# EAGLE design RS14-BatLockPCB (EAGLE 6.5.0)
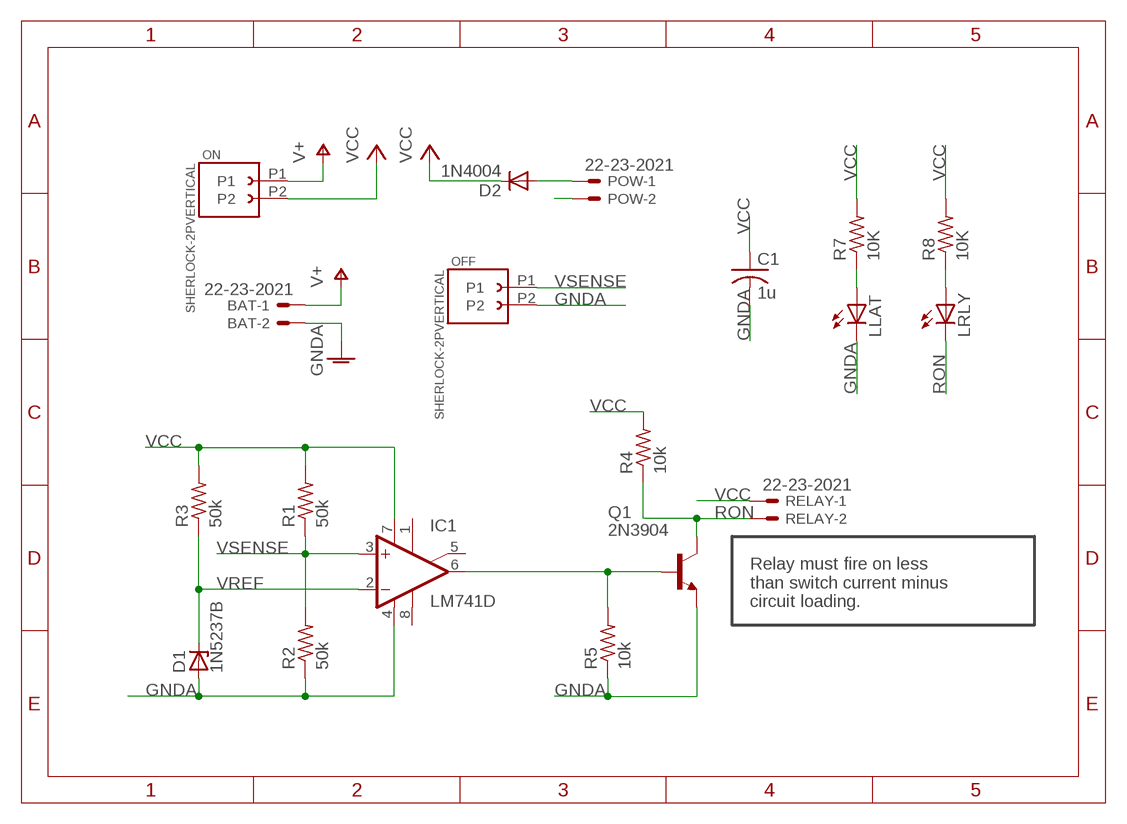
[diagram p0: schematic, sheet 1]

## Parts
BAT  22-23-2021  [22-23-2021]
C1  1u  C-US025-025X050  [C025-025X050]
D1  1N5237B  1N821  [DO35Z10]
D2  1N4004  [DO41-10]
IC1  LM741D  [SO08]
LLAT  LED3MM  [LED3MM]
LRLY  LED3MM  [LED3MM]
OFF  SHERLOCK-2PVERTICAL  [35362-02**]
ON  SHERLOCK-2PVERTICAL  [35362-02**]
POW  22-23-2021  [22-23-2021]
Q1  2N3904  [TO92]
R1  50k  R-US_0204/7  [0204/7]
R2  50k  R-US_0204/7  [0204/7]
R3  50k  R-US_0204/7  [0204/7]
R4  10k  R-US_0204/7  [0204/7]
R5  10k  R-US_0204/7  [0204/7]
R7  10K  R-US_0204/7  [0204/7]
R8  10K  R-US_0204/7  [0204/7]
RELAY  22-23-2021  [22-23-2021]

## Nets
GNDA: BAT.2 C1.2 D1.A IC1.4(V-) LLAT.K(C) OFF.P2 Q1.3(E) R2.1 R5.1
N$1: IC1.6(OUT) Q1.2(B) R5.2
N$2: POW.2
N$4: D2.A POW.1
N$7: LLAT.A R7.1
N$8: LRLY.A R8.1
RON: LRLY.K(C) Q1.1(C) R4.1 RELAY.2
V+: BAT.1 ON.P1
VCC: C1.1 D2.C IC1.7(V+) ON.P2 R1.2 R3.2 R4.2 R7.2 R8.2 RELAY.1
VREF: D1.C IC1.2(-IN) R3.1
VSENSE: IC1.3(+IN) OFF.P1 R1.1 R2.2
Unconnected: IC1.1(ON1) IC1.5(ON2) IC1.8(OPT)

## Notes on the sheet
- Relay must fire on less
  than switch current minus
  circuit loading.

## Library data of the parts
BAT POW RELAY = con-molex:22-23-2021: .100" (2.54mm) Center Header - 2 Pin; MF: MOLEX; MPN: 22-23-2021; OC_FARNELL: 1462926; OC_NEWARK: 25C3832
C1 = rcl:C-US: CAPACITOR, American symbol
D1 = diode:1N821: Reference DIODE temperature compensated, 6,2 V
D2 = diode:1N4004: DIODE general purpose rectifier, 1 A
IC1 = linear:*741: OP AMP
LLAT LRLY = led:LED: LED OSRAM: - CHIPLED LG R971, LG N971, LY N971, LG Q971, LY Q971, LO R971, LY R971 LH N974, LH R974 LS Q976, LO Q976, LY Q976 LO Q996 - Hyper CHIPLED LW Q18S LB Q993, LB Q99A, LB R99A - SideLED LS A670, LO A670, LY A670, LG A670, LP A670 LB A673, LV A673, LT A673, LW A673 LH A674 LY A675 LS A676, LA A676, LO A676, LY A676, LW A676 LS A679, LY A679, LG A679 - Hyper Micro SIDELED® LS Y876, LA Y876, LO Y876, LY Y876 LT Y87S - SmartLED LW L88C, LW L88S LB L89C, LB L89S, LG L890 LS L89K, LO L89K, LY L89K LS L896, LA L896, LO L896, LY L896 - TOPLED LS T670, LO T670, LY T670, LG T670, LP T670 LSG T670, LSP T670, LSY T670, LOP T670, LYG T670 LG T671, LOG T671, LSG T671 LB T673, LV T673, LT T673, LW T673 LH T674 LS T676, LA T676, LO T676, LY T676, LB T676, LH T676, LSB T676, LW T676 LB T67C, LV T67C, LT T67C, LS T67K, LO T67K, LY T67K, LW E67C LS E67B, LA E67B, LO E67B, LY E67B, LB E67C, LV E67C, LT E67C LW T67C LS T679, LY T679, LG T679 LS T770, LO T770, LY T770, LG T770, LP T770 LB T773, LV T773, LT T773, LW T773 LH T774 LS E675, LA E675, LY E675, LS T675 LS T776, LA T776, LO T776, LY T776, LB T776 LHGB T686 LT T68C, LB T68C - Hyper Mini TOPLED® LB M676 - Mini TOPLED Santana® LG M470 LS M47K, LO M47K, LY M47K Source: http://www.osram.convergy.de LUXEON: - LUMILED® LXK2-PW12-R00, LXK2-PW12-S00, LXK2-PW14-U00, LXK2-PW14-V00 LXK2-PM12-R00, LXK2-PM12-S00, LXK2-PM14-U00 LXK2-PE12-Q00, LXK2-PE12-R00, LXK2-PE12-S00, LXK2-PE14-T00, LXK2-PE14-U00 LXK2-PB12-K00, LXK2-PB12-L00, LXK2-PB12-M00, LXK2-PB14-N00, LXK2-PB14-P00, LXK2-PB14-Q00 LXK2-PR12-L00, LXK2-PR12-M00, LXK2-PR14-Q00, LXK2-PR14-R00 LXK2-PD12-Q00, LXK2-PD12-R00, LXK2-PD12-S00 LXK2-PH12-R00, LXK2-PH12-S00 LXK2-PL12-P00, LXK2-PL12-Q00, LXK2-PL12-R00 Source: www.luxeon.com KINGBRIGHT: KA-3528ASYC Source: www.kingbright.com
OFF ON = rs-molex-sherlock:SHERLOCK-2P: 2-pin Molex SherlockTM connector system Verticle 35362-02** Right Angle 35363-026** Mates with: 35507-0200 header 50212-8100 pins Use 63819-0500 crimper, and 57105-6000 pin extraction tool.
Q1 = transistor-npn:2N3904: NPN Transistor
R1-R5 R7 R8 = rcl:R-US_: RESISTOR, American symbol

## Net classes
0 default: clearance 0.205 mm

## Board
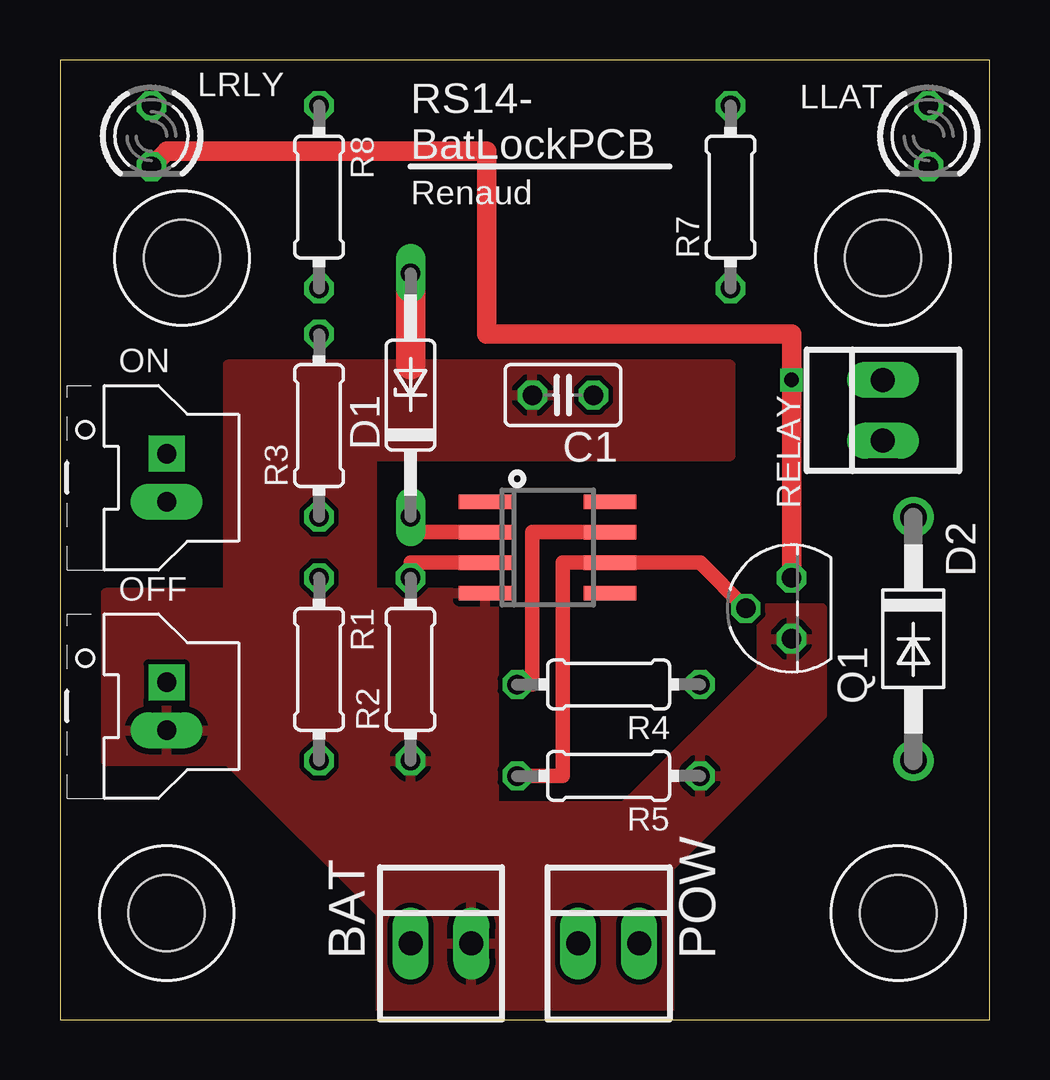
[diagram p1: board, top side]
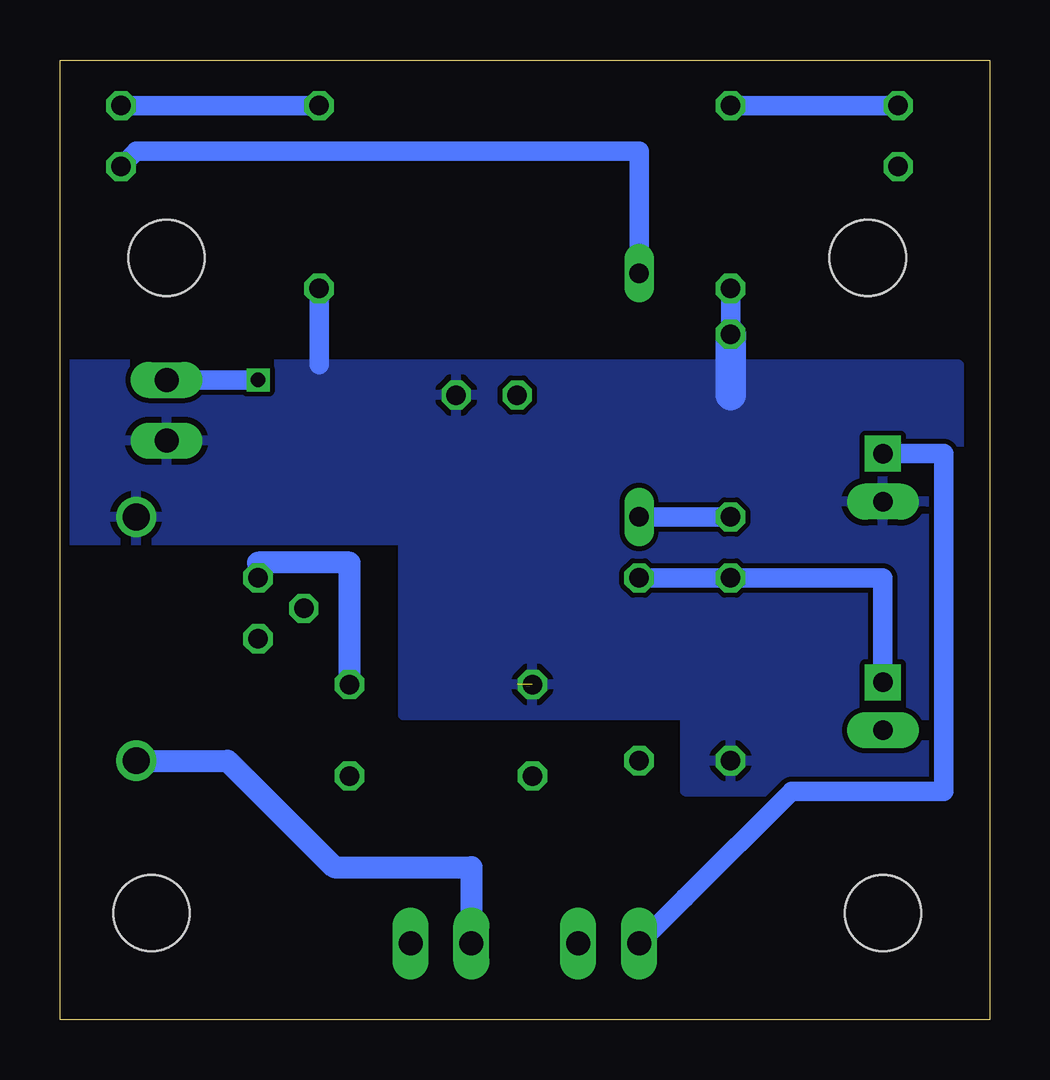
[diagram p2: board, bottom side, seen from below]

Size 38.73 x 40 mm. Coordinates in mm from the lower left corner, seen from the top.
Outline: 0,0 38.73,0 38.73,40 0,40 0,0
Copper layers (1*16): Top 0.0356mm / dielectric 1.5011mm / Bottom 0.0356mm
Design rules "LaenPCBOrder": minimum track width 6mil, minimum drill 13mil, track to track 6mil, track to pad 6mil, pad to pad 6mil, via to via 6mil, smd to smd 6mil, copper to edge 15mil, drill to drill 6mil, minimum pad ring 7mil, minimum via ring 7mil, stop-mask expansion 4mil, vias tented up to drill 0mil, thermal gap 10mil
Holes 3.17 mm at 4.45,4.45 34.93,4.45 34.29,31.75 5.08,31.75

### Footprints (pad centres in the part's own frame; a part is rotated, then mirrored left to right if it is on the bottom)
22-23-2021 = drill 1 long: 1 -1.27,0; 2 1.27,0
C025-025X050 = drill 0.813 octagon: 1 -1.27,0; 2 1.27,0
DO35Z10 = drill 0.813 long: A 5.08,0; C -5.08,0
DO41-10 = drill 1.118: A 5.08,0; C -5.08,0
SO08 = smd 0.6 x 2.2: 1 -1.905,-2.6; 2 -0.635,-2.6; 3 0.635,-2.6; 4 1.905,-2.6; 5 1.905,2.6; 6 0.635,2.6; 7 -0.635,2.6; 8 -1.905,2.6
LED3MM = drill 0.813 octagon: A -1.27,0; K 1.27,0
35362-02** = drill 0.8 pad 1.5 square: P1 -2,0 | drill 0.8 pad 1.5 long: P2 0,0
TO92 = drill 0.813 octagon: 1 1.27,0; 2 0,1.905; 3 -1.27,0
0204/7 = drill 0.813 octagon: 1 -3.81,0; 2 3.81,0

### Placement (x,y rotation side)
BAT  15.88,3.18 0 top
C1  20.95,26.04 180 top
D1  14.61,26.04 90 top
D2  35.56,15.87 270 top
IC1  20.32,19.69 270 top
LLAT  36.2,36.83 270 top
LRLY  3.81,36.83 270 top
OFF  4.45,12.06 270 top
ON  4.45,21.59 270 top
POW  22.86,3.18 0 top
Q1  30.48,17.14 90 top
R1  10.79,14.6 270 top
R2  14.61,14.6 90 top
R3  10.79,24.77 90 top
R4  22.86,13.97 180 top
R5  22.86,10.16 180 top
R7  27.94,34.29 270 top
R8  10.79,34.29 270 top
RELAY  34.29,25.4 90 top

### Tracks (layer width: path | path; a pad name or v marks a point on that pad's centre or on a via)
GNDA
  Top 1.219: D1.A 14.61,27.3
  Bottom 0.813: LLAT.K 35.56,36.2 14.61,36.2 D1.A
  pour Top: 25.4,0 25.4,6.35 31.75,12.7 31.75,17.14 29.21,17.14 29.21,14.6 23.49,8.89 18.1,8.89 18.1,17.78 13.02,17.78 13.02,23.5 27.94,23.5 27.94,27.3 6.99,27.3 6.99,17.78 1.91,17.78 1.91,10.79 6.99,10.79 13.34,4.45 13.34,0
N$1
  Top 0.61: Q1.2 26.67,19.05 IC1.6 20.95,19.05 20.95,10.16 R5.2
N$4
  Bottom 0.914: D2.A 31.75,10.79 27.3,6.35 21.59,6.35 POW.1
N$7
  Bottom 0.813: LLAT.A R7.1
N$8
  Bottom 0.813: LRLY.A R8.1
RON  (via drill 0.6)
  Top 0.813: Q1.1 v30.48,26.67 30.48,28.57 17.78,28.57 17.78,36.2 4.45,36.2 LRLY.K
  Bottom 0.813: RELAY.2 v30.48,26.67
  Bottom 0.914: R4.1 26.67,19.05 30.48,19.05 Q1.1
V+
  Bottom 0.813: ON.P1 1.91,23.59 1.91,9.53 8.26,9.53 12.7,5.08 BAT.1
VCC  (1 unrouted)
  Top 0.61: IC1.7 19.68,20.32 19.68,13.97
  Bottom 0.813: R7.2 27.94,27.3 | R8.2 R3.2
  Bottom 1.27: R3.2 10.79,26.04
  pour Bottom: 1.27,27.3 38.73,27.3 38.73,20 24.45,20 24.45,12.7 12.7,12.7 12.7,9.53 1.27,9.53
VREF
  Top 0.61: IC1.2 14.61,20.32 D1.C
  Bottom 0.813: D1.C R3.1
VSENSE
  Top 0.61: IC1.3 14.61,19.05 R2.2
  Bottom 0.813: OFF.P1 4.45,18.42 R1.1 R2.2

### Text on the board
tNames: RS14- / BatLockPCB | Renaud
bValues: NOTE: ON sig. / powers circuit / in startup.